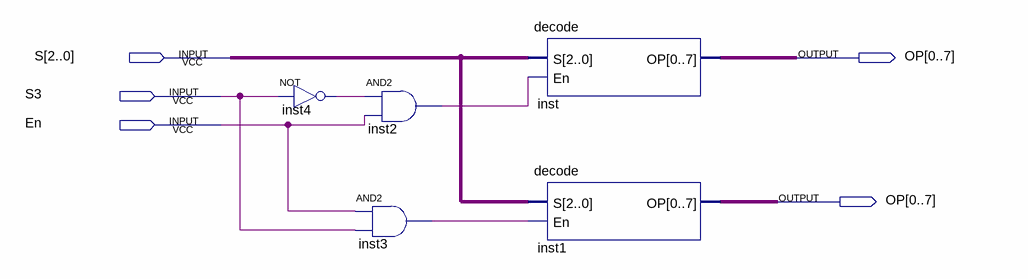
[diagram p0: schematic sheet]
// Quartus schematic decode3to8.bdf as structural Verilog: 5 symbols, 5 pins
module decode3to8 (
  input  [2:0] S,
  input  S3,
  input  En,
  output [0:7] OP
);

  wire inst2_out, inst3_out, inst4_out;

  not inst4 (inst4_out, S3);
  and inst2 (inst2_out, inst4_out, En);
  and inst3 (inst3_out, En, S3);
  decode inst (.S(S), .En(inst2_out), .OP(OP));
  decode inst1 (.S(S), .En(inst3_out), .OP(OP));
endmodule
